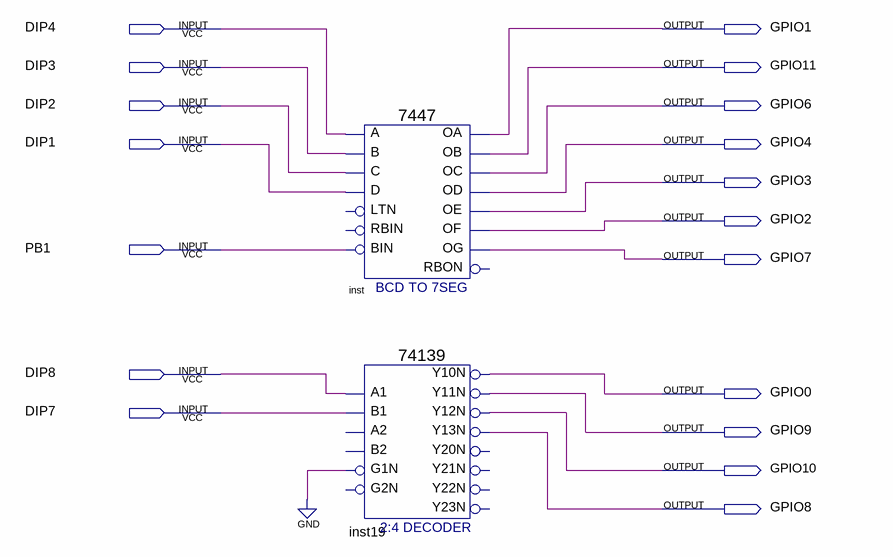
[diagram p0: schematic sheet]
// Quartus schematic circuitoFigura1.bdf as structural Verilog: 2 symbols, 18 pins
module circuitoFigura1 (
  input  DIP4,
  input  DIP3,
  input  DIP2,
  input  DIP1,
  input  PB1,
  input  DIP8,
  input  DIP7,
  output GPIO1,
  output GPIO11,
  output GPIO6,
  output GPIO4,
  output GPIO3,
  output GPIO2,
  output GPIO7,
  output GPIO0,
  output GPIO9,
  output GPIO10,
  output GPIO8
);

  \7447  inst (
    .B(DIP3), .C(DIP2), .D(DIP1), .BIN(PB1), .A(DIP4), .OB(GPIO11), .OC(GPIO6), .OE(GPIO3), .OD(GPIO4),
    .OF(GPIO2), .OG(GPIO7), .OA(GPIO1));  // open: LTN, RBIN, RBON
  \74139  inst19 (
    .A1(DIP8), .B1(DIP7), .G1N(1'b0), .Y10N(GPIO0), .Y13N(GPIO8), .Y12N(GPIO10), .Y11N(GPIO9));  // open: A2, B2, G2N, Y20N, Y21N, Y22N, Y23N
endmodule
